# EAGLE design servopoinB3 (EAGLE 6.6.0)
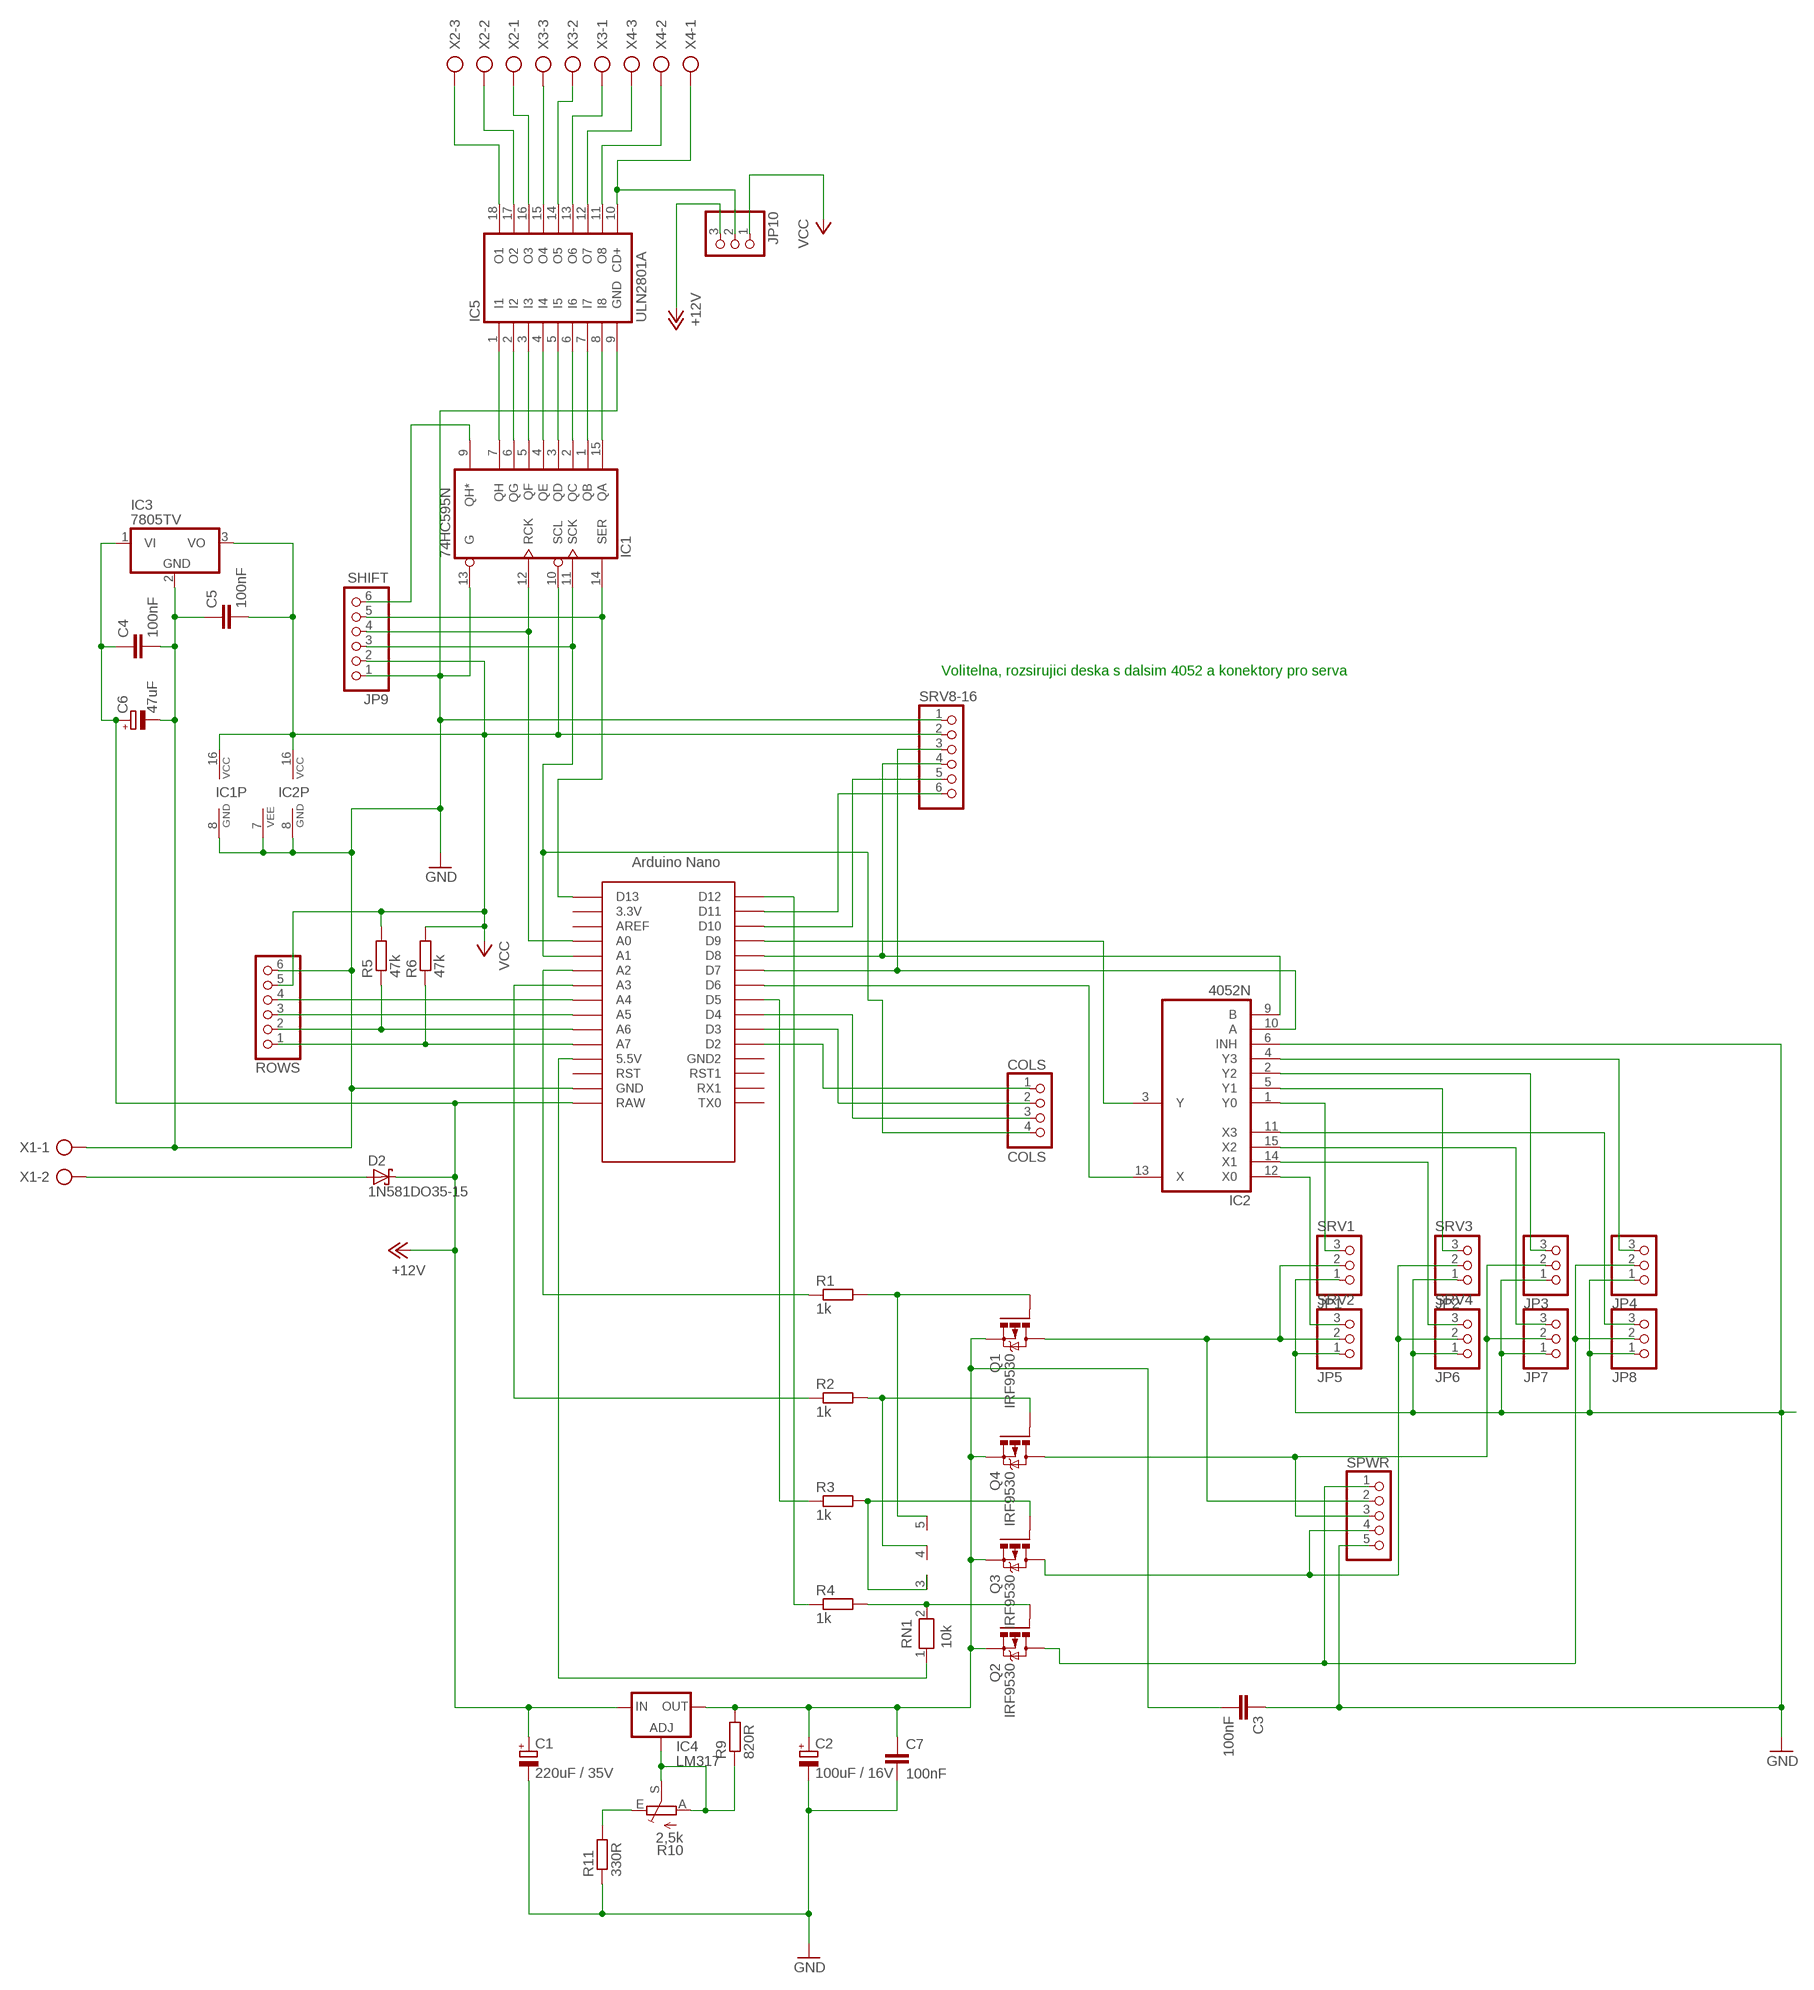
[diagram p0: schematic, sheet 1]

## Parts
C1  220uF / 35V  CPOL-EUE5-10.5  [E5-10,5]
C2  100uF / 16V  CPOL-EUE2.5-5  [E2,5-5]
C3  100nF  C-EU025-025X050  [C025-025X050]
C4  100nF  C-EU025-025X050  [C025-025X050]
C5  100nF  C-EU025-025X050  [C025-025X050]
C6  47uF  CPOL-EUE2.5-6  [E2,5-6]
C7  100nF  C-EU025-025X050  [C025-025X050]
COLS  COLS  PINHD-1X4  [1X04]
D2  1N581DO35-15  [DO35-10]
IC1  74HC595N  [DIL16]
IC2  4052N  [DIL16]
IC3  7805TV  [TO220V]
IC4  LM317  LM317TS  [317TS]
IC5  ULN2801A  [DIL18]
JP1  SRV1  PINHD-1X3  [1X03]
JP2  SRV3  PINHD-1X3  [1X03]
JP3  PINHD-1X3  [1X03]
JP4  PINHD-1X3  [1X03]
JP5  SRV2  PINHD-1X3  [1X03]
JP6  SRV4  PINHD-1X3  [1X03]
JP7  PINHD-1X3  [1X03]
JP8  PINHD-1X3  [1X03]
JP9  SHIFT  PINHD-1X6  [1X06]
JP10  PINHD-1X3  [1X03]
Q1  IRF9530  [TO220BV]
Q2  IRF9530  [TO220BV]
Q3  IRF9530  [TO220BV]
Q4  IRF9530  [TO220BV]
R1  1k  R-EU_0207/10  [0207/10]
R2  1k  R-EU_0207/10  [0207/10]
R3  1k  R-EU_0207/10  [0207/10]
R4  1k  R-EU_0207/10  [0207/10]
R5  47k  R-EU_0207/10  [0207/10]
R6  47k  R-EU_0207/10  [0207/10]
R9  820R  R-EU_0207/10  [0207/10]
R10  2,5k  TRIM_EU-LI10-PADS  [LI10]
R11  330R  R-EU_0207/10  [0207/10]
RN1  10k  RN04  [RN-5]
ROWS  PINHD-1X6  [1X06]
SPWR  PINHD-1X5  [1X05]
SRV8-16  PINHD-1X6  [1X06]
U$1  NANO  [NANO]
X1  AK500/2  [AK500/2]
X2  AK500/3  [AK500/3]
X3  AK500/3  [AK500/3]
X4  AK500/3  [AK500/3]

## Nets
+12V: C1.+ C4.1 C6.+ D2.C IC3.1(VI) IC4.3(IN) JP10.3 U$1.RAW
GND: C1.- C2.- C3.1 C4.2 C5.1 C6.- C7.2 IC1.8(GND) IC1.13(G) IC2.6(INH) IC2.7(VEE) IC2.8(GND) IC3.2(GND) IC5.9(GND) JP1.1 JP2.1 JP3.1 JP4.1 JP5.1 JP6.1 JP7.1 JP8.1 JP9.1 R11.1 ROWS.6 SPWR.5 SRV8-16.1 U$1.GND X1.1
N$1: IC2.13(X) U$1.D6
N$2: IC2.3(Y) U$1.D9
N$3: IC1.15(QA) IC5.8(I8)
N$4: COLS.4 IC1.11(SCK) JP9.3 U$1.A1
N$5: IC2.12(X0) JP5.3
N$6: IC2.1(Y0) JP1.3
N$7: IC2.14(X1) JP6.3
N$8: IC2.5(Y1) JP2.3
N$9: IC2.15(X2) JP7.3
N$10: IC2.2(Y2) JP3.3
N$11: IC2.11(X3) JP8.3
N$12: IC2.4(Y3) JP4.3
N$13: Q1.G R1.2 RN1.5
N$14: JP2.2 JP6.2 Q3.D SPWR.4
N$15: R6.1 ROWS.1 U$1.A7
N$16: R2.1 U$1.A3
N$17: Q4.G R2.2 RN1.4
N$18: R3.1 U$1.D5
N$19: Q3.G R3.2 RN1.3
N$20: RN1.1 U$1.5V(5.5V)
N$21: Q2.G R4.2 RN1.2
N$22: JP3.2 JP7.2 Q4.D SPWR.3
N$23: R4.1 U$1.D12
N$24: R1.1 U$1.A2
N$25: D2.A X1.2
N$26: ROWS.4 U$1.A4
N$27: ROWS.3 U$1.A5
N$28: R5.1 ROWS.2 U$1.A6
N$30: SRV8-16.6 U$1.D11
N$31: COLS.2 U$1.D3
N$32: COLS.3 U$1.D4
N$33: COLS.1 U$1.D2
N$34: SRV8-16.5 U$1.D10
N$35: IC1.14(SER) JP9.5 U$1.D13
N$36: IC1.1(QB) IC5.7(I7)
N$37: IC1.9(QH*) JP9.6
N$38: IC1.12(RCK) JP9.4 U$1.A0
N$39: C2.+ C3.2 C7.1 IC4.2(OUT) Q1.S Q2.S Q3.S Q4.S R9.2
N$40: IC5.10(CD+) JP10.2 X4.1
N$41: IC1.2(QC) IC5.6(I6)
N$42: IC1.3(QD) IC5.5(I5)
N$43: IC1.4(QE) IC5.4(I4)
N$44: IC1.5(QF) IC5.3(I3)
N$45: IC1.6(QG) IC5.2(I2)
N$46: IC1.7(QH) IC5.1(I1)
N$47: IC5.18(O1) X2.3
N$49: IC4.1(ADJ) R9.1 R10.A R10.S
N$50: R10.E R11.2
N$51: IC5.17(O2) X2.2
N$53: JP1.2 JP5.2 Q1.D SPWR.2
N$57: IC5.16(O3) X2.1
N$58: JP4.2 JP8.2 Q2.D SPWR.1
N$59: IC5.15(O4) X3.3
N$60: IC5.14(O5) X3.2
N$61: IC5.13(O6) X3.1
N$62: IC5.12(O7) X4.3
N$63: IC5.11(O8) X4.2
N$64: IC2.9(B) SRV8-16.4 U$1.D8
N$65: IC2.10(A) SRV8-16.3 U$1.D7
VCC: C5.2 IC1.10(SCL) IC1.16(VCC) IC2.16(VCC) IC3.3(VO) JP9.2 JP10.1 R5.2 R6.2 ROWS.5 SRV8-16.2
Unconnected: U$1.3.3V U$1.AREF U$1.GND1(GND2) U$1.ICSP1 U$1.ICSP2 U$1.ICSP3 U$1.ICSP4 U$1.ICSP5 U$1.ICSP6 U$1.RST U$1.RST1 U$1.RX1 U$1.TX0

## Notes on the sheet
- Volitelna, rozsirujici deska s dalsim 4052 a konektory pro serva

## Library data of the parts
C1 C2 = resistor:CPOL-EU: POLARIZED CAPACITOR, European symbol
C3 C7 = resistor:C-EU: CAPACITOR, European symbol
C4 C5 = rcl:C-EU: CAPACITOR, European symbol
C6 = rcl:CPOL-EU: POLARIZED CAPACITOR, European symbol
COLS = pinhead:PINHD-1X4: PIN HEADER
D2 = custom:1N581*: 1.0A SCHOTTKY BARRIER RECTIFIER Source: http://www.diodes.com/datasheets/ds23001.pdf
IC1 = 74xx-eu:74*595: 8-bit SHIFT REGISTER, output latch
IC2 = 40xx:4052: Dual 4-channel ANALOG MULTIPLEXER
IC3 = linear:78*: Positive VOLTAGE REGULATOR Source: http://cache.national.com/ds/LM/LM78L05.pdf http://www.fairchildsemi.com/ds/LM/LM7805.pdf
IC4 = v-reg:LM317TS: VOLTAGE REGULATOR
IC5 = uln-udn:ULN2801A: DRIVER ARRAY
JP1-JP8 JP10 = pinhead:PINHD-1X3: PIN HEADER
JP9 ROWS SRV8-16 = pinhead:PINHD-1X6: PIN HEADER
Q1-Q4 = transistor-power:IRF9530: P-CHANNEL HEXFET POWER-MOS-FET Source: http://www.irf.com/product-info/datasheets/data/irf9530.pdf
R1-R6 R9 R11 = resistor:R-EU_: RESISTOR, European symbol
R10 = custom:TRIM_EU-: POTENTIOMETER
RN1 = resistor-net:RN04: RESISTOR NETWORK; OC_FARNELL: unknown; OC_NEWARK: unknown
SPWR = pinhead:PINHD-1X5: PIN HEADER
U$1 = Arduino-clone:NANO: Arduino Nano
X1 = con-ptr500:AK500/2: CONNECTOR; OC_FARNELL: unknown; OC_NEWARK: unknown
X2-X4 = con-ptr500:AK500/3: CONNECTOR; OC_FARNELL: unknown; OC_NEWARK: unknown

## Board
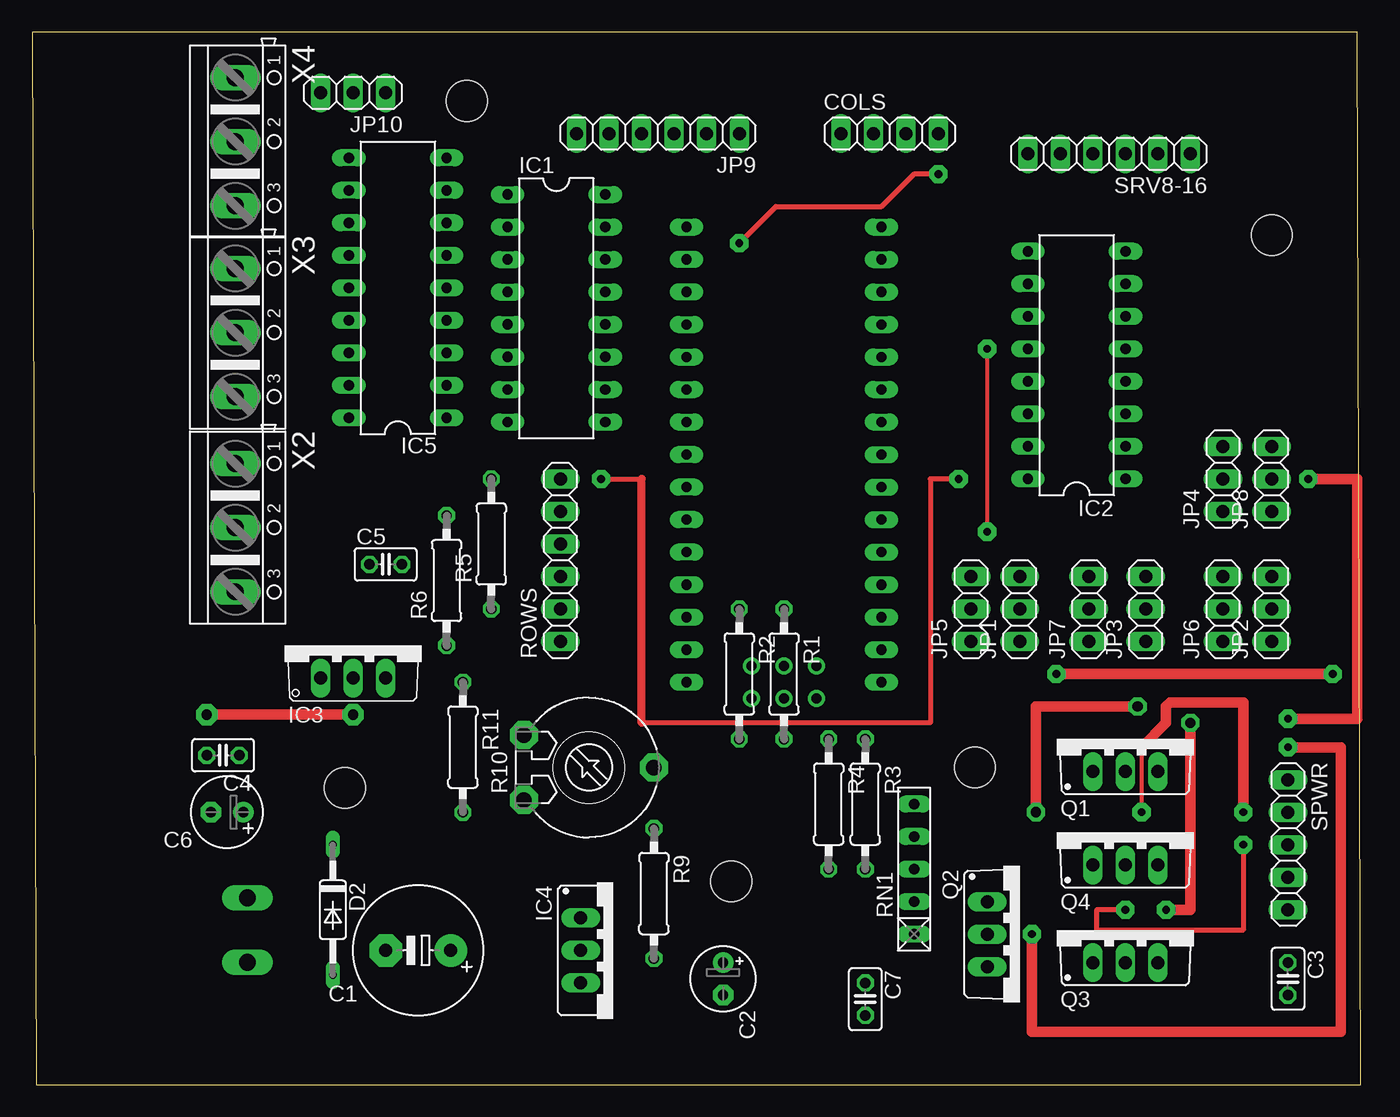
[diagram p1: board, top side]
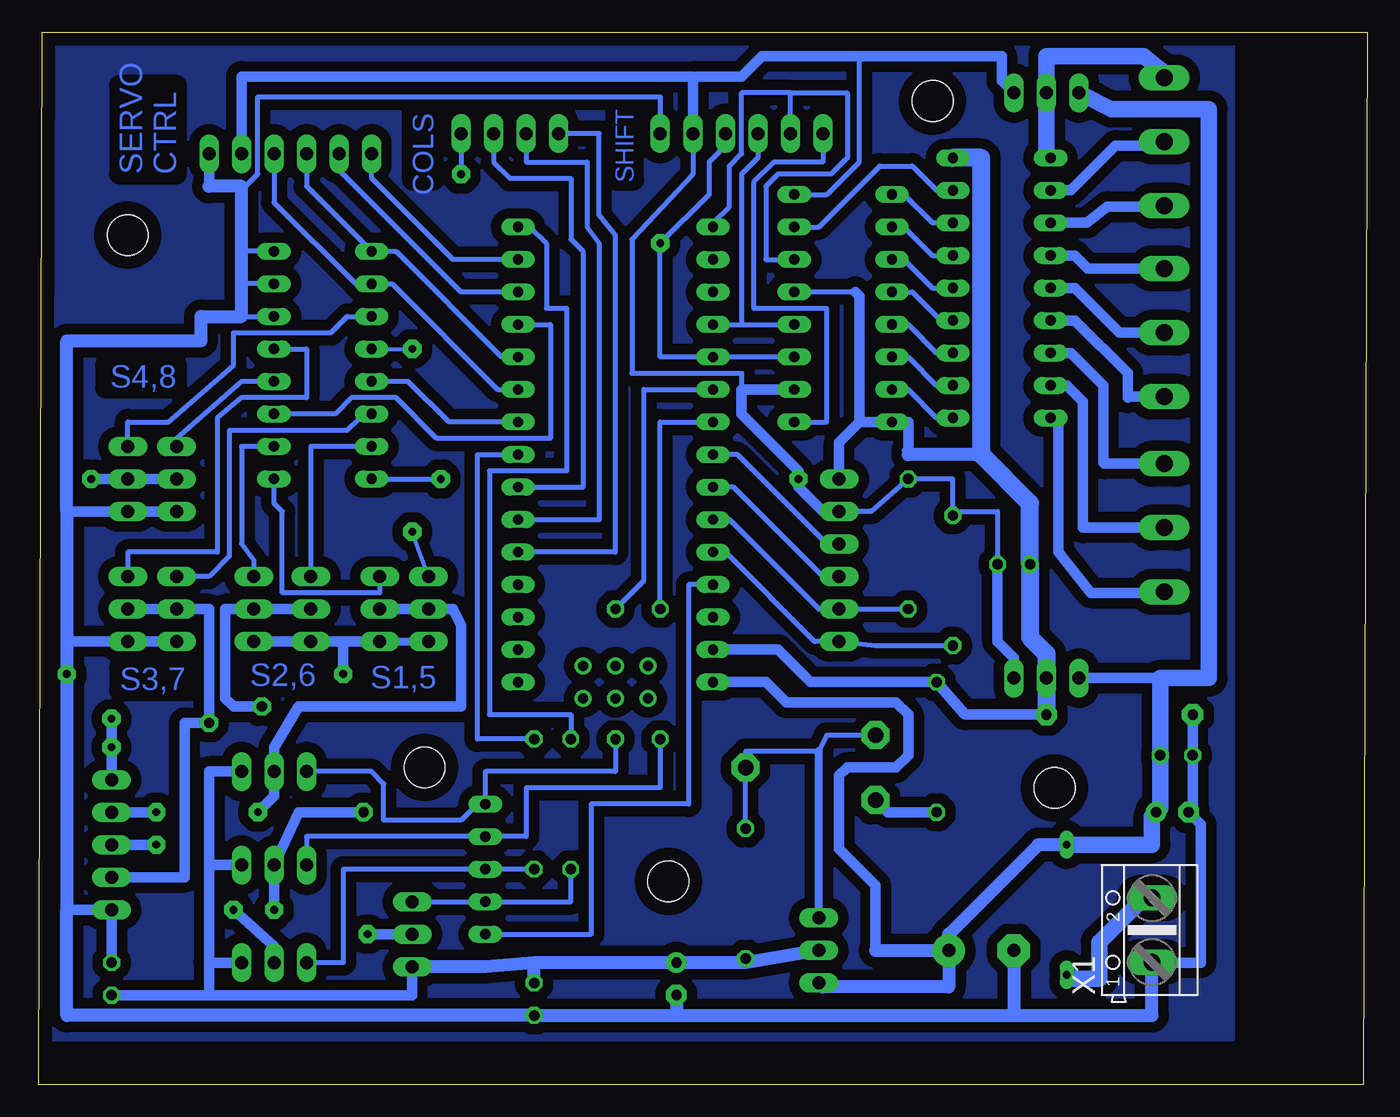
[diagram p2: board, bottom side, seen from below]

Size 103.81 x 82.22 mm. Coordinates in mm from the lower left corner, seen from the top.
Outline: 0.32,0 103.81,0 103.52,82.22 0,82.22 0.32,0
Copper layers (1*16): Top 0.035mm / dielectric 1.5mm / Bottom 0.035mm
Design rules "default *": minimum track width 10mil, minimum drill 0.6mm, track to track 8mil, track to pad 8mil, pad to pad 8mil, via to via 8mil, smd to smd 8mil, copper to edge 40mil, drill to drill 8mil, minimum pad ring 10mil, minimum via ring 8mil, stop-mask expansion 4mil, vias tented up to drill 0mil, thermal gap 10mil
Holes 3.2 mm at 96.84,66.36 54.61,15.88 73.66,24.77 24.45,23.18 33.97,76.84

### Footprints (pad centres in the part's own frame; a part is rotated, then mirrored left to right if it is on the bottom)
E5-10,5 = drill 1.016 pad 2.54: + -2.54,0 | drill 1.016 pad 2.54 octagon: - 2.54,0
E2,5-5 = drill 0.813 pad 1.6: + -1.27,0 | drill 0.813 pad 1.6 octagon: - 1.27,0
C025-025X050 = drill 0.813 octagon: 1 -1.27,0; 2 1.27,0
E2,5-6 = drill 0.813 pad 1.6: + -1.27,0 | drill 0.813 pad 1.6 octagon: - 1.27,0
1X04 = drill 1.016 long: 1 -3.81,0; 2 -1.27,0; 3 1.27,0; 4 3.81,0
DO35-10 = drill 0.6 long: A 5.08,0; C -5.08,0
DIL16 = drill 0.813 long: 1 -8.89,-3.81; 2 -6.35,-3.81; 3 -3.81,-3.81; 4 -1.27,-3.81; 5 1.27,-3.81; 6 3.81,-3.81; 7 6.35,-3.81; 8 8.89,-3.81; 9 8.89,3.81; 10 6.35,3.81; 11 3.81,3.81; 12 1.27,3.81; 13 -1.27,3.81; 14 -3.81,3.81; 15 -6.35,3.81; 16 -8.89,3.81
TO220V = drill 1.016 long: 1 -2.54,-2.54; 2 0,-2.54; 3 2.54,-2.54
317TS = drill 1.016 long: 1 -2.54,-2.54; 2 0,-2.54; 3 2.54,-2.54
DIL18 = drill 0.813 long: 1 -10.16,-3.81; 2 -7.62,-3.81; 3 -5.08,-3.81; 4 -2.54,-3.81; 5 0,-3.81; 6 2.54,-3.81; 7 5.08,-3.81; 8 7.62,-3.81; 9 10.16,-3.81; 10 10.16,3.81; 11 7.62,3.81; 12 5.08,3.81; 13 2.54,3.81; 14 0,3.81; 15 -2.54,3.81; 16 -5.08,3.81; 17 -7.62,3.81; 18 -10.16,3.81
1X03 = drill 1.016 long: 1 -2.54,0; 2 0,0; 3 2.54,0
1X06 = drill 1.016 long: 1 -6.35,0; 2 -3.81,0; 3 -1.27,0; 4 1.27,0; 5 3.81,0; 6 6.35,0
TO220BV = drill 1.016 long: D 0,-2.54; G -2.54,-2.54; S 2.54,-2.54
0207/10 = drill 0.813 octagon: 1 -5.08,0; 2 5.08,0
LI10 = drill 1.2 pad 2.184 octagon: A -2.54,-5.08; E 2.54,-5.08; S 0,5.08
RN-5 = drill 0.813 long: 1 -5.08,0; 2 -2.54,0; 3 0,0; 4 2.54,0; 5 5.08,0
1X05 = drill 1.016 long: 1 -5.08,0; 2 -2.54,0; 3 0,0; 4 2.54,0; 5 5.08,0
NANO = drill 0.8 long: 3.3V -10.16,24.13; 5V -10.16,-1.27; A0 -10.16,19.05; A1 -10.16,16.51; A2 -10.16,13.97; A3 -10.16,11.43; A4 -10.16,8.89; A5 -10.16,6.35; A6 -10.16,3.81; A7 -10.16,1.27; AREF -10.16,21.59; D2 5.08,1.27; D3 5.08,3.81; D4 5.08,6.35; D5 5.08,8.89; D6 5.08,11.43; D7 5.08,13.97; D8 5.08,16.51; D9 5.08,19.05; D10 5.08,21.59; D11 5.08,24.13; D12 5.08,26.67; D13 -10.16,26.67; GND -10.16,-6.35; GND1 5.08,-1.27; RAW -10.16,-8.89; RST -10.16,-3.81; RST1 5.08,-3.81; RX1 5.08,-6.35; TX0 5.08,-8.89 | drill 0.8: ICSP1 -5.08,-10.16; ICSP2 -5.08,-7.62; ICSP3 -2.54,-10.16; ICSP4 -2.54,-7.62; ICSP5 0,-10.16; ICSP6 0,-7.62
AK500/2 = drill 1.321 long: 1 -2.515,0; 2 2.515,0
AK500/3 = drill 1.321 long: 1 -5.004,0; 2 0,0; 3 5.004,0

### Placement (x,y rotation side)
C1  30.16,10.48 180 top
C2  53.98,8.26 270 top
C3  98.11,8.26 270 top
C4  14.92,25.72 180 top
C5  27.62,40.64 0 top
C6  15.24,21.27 180 top
C7  65.09,6.67 270 top
COLS  66.99,74.3 0 top
D2  23.49,13.65 270 top
IC1  40.96,60.64 270 top
IC2  81.6,56.2 90 top
IC3  25.08,34.29 0 top
IC4  45.4,10.48 270 top
IC5  28.57,62.23 90 top
JP1  77.15,37.15 90 top
JP2  96.84,37.15 90 top
JP3  87,37.15 90 top
JP4  93.03,47.31 90 top
JP5  73.34,37.15 90 top
JP6  93.03,37.15 90 top
JP7  82.55,37.15 90 top
JP8  96.84,47.31 90 top
JP9  48.9,74.3 180 top
JP10  25.08,77.47 180 top
Q1  85.41,26.99 0 top
Q2  77.15,11.75 270 top
Q3  85.41,12.06 0 top
Q4  85.41,19.69 0 top
R1  58.74,32.07 270 top
R2  55.24,32.07 270 top
R3  65.09,21.91 270 top
R4  62.23,21.91 270 top
R5  35.88,42.23 90 top
R6  32.39,39.37 90 top
R9  48.58,14.92 270 top
R10  43.5,24.77 270 top
R11  33.66,26.35 270 top
RN1  68.9,16.83 90 top
ROWS  41.27,40.96 90 top
SPWR  98.11,18.73 270 top
SRV8-16  84.14,72.71 180 top
U$1  61.28,40.32 0 top
X1  16.83,12.06 90 bottom
X2  15.88,43.5 270 top
X3  15.88,58.74 270 top
X4  15.88,73.66 270 top

### Tracks (layer width: path | path; a pad name or v marks a point on that pad's centre or on a via)
+12V
  Bottom 0.813: IC3.1 16.19,31.75 | U$1.RAW 46.99,31.43 45.4,29.85 36.83,29.85 35.88,28.89 35.88,25.72 36.83,24.77 40.64,24.77 41.27,24.13 41.27,18.42 38.42,15.56 38.42,10.48 | 16.83,20.96 C6.+ 16.19,21.59
  Bottom 1.016: C1.+ 32.7,7.62 42.55,7.62 IC4.3 | D2.C 25.72,18.73 32.7,11.75 C1.+ | 38.42,10.48 C1.+
  Bottom 1.27: JP10.3 20,76.2 12.38,76.2 12.38,31.75 16.19,31.75 C4.1 16.19,21.59 | D2.C 16.83,18.73 16.83,20.96
AAA
  pour Bottom (isolate 0.813): 10.48,81.92 103.19,81.92 103.19,3.49 10.48,3.49
GND  (via drill 0.6 pad 1.42, 0.8 pad 1.68)
  Top 0.813: v101.6,32.07 v80.01,32.07 | v25.08,28.89 v13.65,28.89
  Bottom 0.406: IC1.8 35.88,51.75 | IC2.8 87.95,65.09 | 87.95,60.01 IC2.6 | 39.69,61.91 40.01,61.91 IC1.13 | IC2.7 87.63,62.55 87.95,62.86 | 87.95,70.17 87.63,70.17 86.68,71.12 86.68,77.15 55.24,77.15 JP9.1 | 35.88,49.21 36.2,49.53 | 43.5,31.43 43.81,31.75
  Bottom 0.61: JP1.1 JP5.1
  Bottom 0.813: JP1.1 80.01,34.61 | 80.01,34.61 JP7.1 JP3.1 | JP6.1 JP2.1 101.6,34.61 | JP4.1 JP8.1 101.6,44.77 | 101.6,13.65 SPWR.5 C3.1 | IC2.6 86.04,60.01 | 90.49,70.17 SRV8-16.1 | 35.88,51.75 35.88,49.21 | IC1.8 39.69,51.75 | 39.69,51.75 39.69,61.59 40.01,61.91 | IC5.9 33.02,72.39 | U$1.GND 46.04,33.97 43.81,31.75 | ROWS.6 41.27,50.16 39.69,51.75 | 80.01,34.61 v80.01,32.07 | v25.08,28.89 31.43,28.89 R11.1 43.5,31.43 | 16.54,9.84 X1.1 16.8,9.53 13.02,9.53 13.02,20.32 C6.- 13.65,21.59 C4.2 v13.65,28.89
  Bottom 1.016: 90.49,70.17 87.95,70.17 87.95,65.09 87.95,62.86 87.95,60.01 91.12,60.01 91.12,58.1 101.6,58.1 101.6,44.77 101.6,34.61 v101.6,32.07 101.6,13.65 101.6,5.4 C7.2 53.98,5.4 | 30.16,49.21 35.88,49.21 | 53.98,5.4 27.62,5.4 | 27.62,5.4 16.83,5.4 X1.1 | C1.- 27.62,5.4 | C2.- 53.98,5.4
  Bottom 1.422: IC5.9 30.16,72.39 30.16,49.21 26.35,45.4 C5.1 26.35,34.92 25.08,33.66 IC3.2 v25.08,28.89
N$1
  Bottom 0.406: U$1.D6 71.76,51.75 74.93,54.93 IC2.13
N$2
  Bottom 0.406: U$1.D9 63.82,59.37 63.82,50.48 72.71,50.48 75.88,53.66 79.38,53.66 80.64,52.39 IC2.3
N$3
  Bottom 0.406: IC1.15 42.86,66.99 38.1,71.76 35.56,71.76 33.66,69.85 IC5.8
N$4  (via drill 0.6 pad 1.42)
  Top 0.406: v70.8,71.12 68.9,71.12 66.36,68.58 58.1,68.58 v55.24,65.72
  Bottom 0.406: IC1.11 U$1.A1 55.24,56.83 v55.24,65.72 51.44,69.53 51.44,72.07 50.16,73.34 JP9.3 | COLS.4 v70.8,71.12
N$5  (via drill 0.6 pad 1.42)
  Top 0.305: v74.61,43.18 v74.61,57.47
  Bottom 0.305: JP5.3 v74.61,43.18 | IC2.12 v74.61,57.47
N$6
  Bottom 0.406: JP1.3 77.15,38.42 84.77,38.42 84.77,44.77 85.41,45.4 IC2.1
N$7
  Bottom 0.406: IC2.14 78.11,52.07 78.74,52.07 79.69,51.12 88.9,51.12 88.9,41.27 90.49,39.69 JP6.3
N$8
  Bottom 0.406: IC2.5 82.87,57.47 82.87,53.66 87.95,53.66 89.85,52.07 89.85,41.59 96.84,41.59 JP2.3
N$9
  Bottom 0.406: IC2.15 82.55,49.85 JP7.3
N$10
  Bottom 0.406: IC2.2 87.95,49.85 87.95,42.23 87,40.96 JP3.3
N$11
  Bottom 0.406: JP8.3 96.84,51.75 93.66,51.75 88.58,56.2 88.58,58.74 80.96,58.74 79.69,60.01 IC2.11
N$12
  Bottom 0.406: IC2.4 87.95,54.93 93.03,50.48 JP4.3
N$13
  Bottom 0.406: R1.2 58.74,24.45 68.9,24.45 RN1.5 69.53,21.91 70.8,20.64 76.83,20.64 76.83,23.5 77.79,24.45 Q1.G
N$14  (via drill 0.6 pad 1.42, 0.8 pad 1.42)
  Top 0.813: v88.58,13.65 90.49,13.65 v90.49,28.26
  Bottom 0.406: 91.12,28.26 v90.49,28.26
  Bottom 0.813: JP2.2 JP6.2 90.49,37.15 v90.49,28.26 | SPWR.4 92.39,16.19 92.39,28.26 91.12,28.26 | Q3.D 85.41,10.79 v88.58,13.65
N$15
  Bottom 0.406: R6.1 38.42,34.29 ROWS.1 43.18,34.61 50.16,41.59 U$1.A7
N$16
  Bottom 0.406: R2.1 55.24,51.75 U$1.A3
N$17
  Bottom 0.406: R2.2 55.24,23.18 65.72,23.18 65.72,19.37 RN1.4 82.87,19.37 Q4.G
N$18
  Bottom 0.406: R3.1 69.53,26.99 69.53,49.21 U$1.D5
N$19
  Bottom 0.406: Q3.G 80.01,9.53 80.01,16.83 RN1.3 R3.2
N$20
  Bottom 0.406: RN1.1 60.64,11.75 60.64,21.91 53.02,21.91 53.02,39.05 U$1.5V
N$21
  Bottom 0.406: Q2.G RN1.2 62.23,14.29 R4.2
N$22  (via drill 0.6 pad 1.42, 0.8 pad 1.42)
  Top 0.406: v94.61,18.73 94.61,12.06 83.19,12.06 83.19,13.65 v85.41,13.65
  Top 0.813: v86.36,29.53 78.42,29.53 v78.42,21.27
  Bottom 0.813: v78.42,21.27 83.5,21.27 Q4.D v85.41,13.65 | JP7.2 JP3.2 89.22,37.15 89.22,30.16 88.58,29.53 v86.36,29.53 | SPWR.3 v94.61,18.73
N$23
  Bottom 0.406: U$1.D12 65.41,66.99 64.13,65.72 64.13,60.64 62.55,60.64 62.55,47.94 68.58,47.94 68.58,28.89 62.23,28.89 R4.1
N$24
  Bottom 0.406: U$1.A2 56.52,54.29 56.52,39.37 R1.1
N$25
  Bottom 1.016: 23.18,8.26 D2.A
  Bottom 1.27: 17.49,14.58 20.96,11.11 20.96,8.26 23.18,8.26
  Bottom 1.422: X1.2 17.49,14.58
N$26
  Bottom 0.406: ROWS.4 42.23,42.23 49.21,49.21 U$1.A4
N$27
  Bottom 0.406: ROWS.3 42.55,39.69 49.53,46.67 U$1.A5
N$28
  Bottom 0.406: R5.1 ROWS.2 42.86,37.15 49.85,44.13 U$1.A6
N$30
  Bottom 0.406: U$1.D11 71.44,64.45 77.79,70.8 SRV8-16.6
N$31
  Bottom 0.406: COLS.2 65.72,72.07 60.96,72.07 60.96,66.99 60.01,65.72 60.01,44.13 U$1.D3
N$32
  Bottom 0.406: COLS.3 68.26,72.07 66.99,70.8 62.23,70.8 62.23,66.04 61.28,65.09 61.28,46.67 U$1.D4
N$33
  Bottom 0.406: COLS.1 60.01,74.3 60.01,67.95 58.74,66.36 58.74,41.59 U$1.D2
N$34
  Bottom 0.406: U$1.D10 70.8,61.91 80.33,71.44 SRV8-16.5
N$35
  Bottom 0.406: JP9.5 45.09,77.47 | 45.09,77.47 40.64,77.47 40.64,72.39 41.91,71.12 46.04,71.12 46.99,70.17 46.99,64.45 IC1.14 | 45.09,77.47 48.9,77.47 48.9,72.71 49.85,71.76 49.85,68.58 51.12,67.31 U$1.D13
N$36
  Bottom 0.406: IC1.1 36.2,69.53 33.97,67.31 IC5.7
N$37
  Bottom 0.406: JP9.6 42.55,72.07 46.35,72.07 47.94,70.48 47.94,60.64 42.23,60.64 42.23,51.75 IC1.9
N$38
  Bottom 0.406: U$1.A0 48.9,59.37 | 48.9,59.37 IC1.12 | 48.9,59.37 48.9,71.12 47.63,72.39 JP9.4
N$39
  Bottom 0.406: R9.2 48.58,9.53
  Bottom 0.813: Q1.S 90.49,24.45 90.49,17.15 | 90.49,17.15 90.49,9.53 | 90.49,9.53 90.49,6.98 | 90.49,6.98 74.61,6.98 Q2.S | Q3.S 90.49,9.53 | Q4.S 90.49,17.15 | C3.2 90.49,6.98
  Bottom 1.016: IC4.2 48.58,9.53 C2.+ 65.09,9.53 | 65.09,9.53 68.9,9.21 Q2.S | C7.1 65.09,9.53
N$40
  Bottom 0.406: X4.1 15.88,79.06
  Bottom 0.813: 25.08,72.71 IC5.10
  Bottom 1.27: 25.08,72.71 JP10.2 25.08,80.33 17.46,80.33 15.88,79.06
N$41
  Bottom 0.406: IC1.2 36.2,66.99 33.97,64.77 IC5.6
N$42
  Bottom 0.406: IC1.3 36.2,64.45 33.97,62.23 IC5.5
N$43
  Bottom 0.406: IC1.4 35.56,61.91 33.34,59.69 IC5.4
N$44
  Bottom 0.406: IC1.5 35.88,59.37 33.66,57.15 IC5.3
N$45
  Bottom 0.406: IC1.6 35.88,56.83 33.66,54.61 IC5.2
N$46
  Bottom 0.406: IC1.7 35.88,54.29 33.66,52.07 IC5.1
N$47
  Bottom 0.406: IC5.18 24.13,52.07 | 16.51,38.42 15.88,39.05 X2.3
  Bottom 0.813: 24.13,52.07 24.13,41.59 21.59,38.42 16.51,38.42
N$49
  Bottom 0.406: R9.1 R10.S 48.58,26.04 42.86,26.04 42.23,27.31 R10.A
  Bottom 0.61: IC4.1 42.86,26.04
N$50
  Bottom 0.813: R11.2 37.46,21.27 R10.E
N$51
  Bottom 0.813: X2.2 22.22,43.5 22.22,53.34 23.49,54.61 IC5.17
N$53  (via drill 0.6 pad 1.42)
  Top 0.305: v86.68,21.27 86.68,26.35
  Top 0.813: v94.61,21.27 94.61,29.85 88.9,29.85 88.58,29.53 88.58,28.26 86.68,26.35
  Bottom 0.813: JP1.2 JP5.2 71.44,37.15 70.8,35.88 70.8,29.53 83.5,29.53 85.41,26.35 Q1.D 85.41,22.54 v86.68,21.27 | SPWR.2 v94.61,21.27
N$57
  Bottom 0.406: 20.56,48.5 20.64,48.58
  Bottom 0.813: X2.1 20.56,48.5 | 20.64,48.58 20.64,54.61 23.18,57.15 IC5.16
N$58  (via drill 0.6 pad 1.42)
  Top 0.813: v98.11,26.35 102.23,26.35 102.23,4.13 78.11,4.13 v78.11,11.75 | v98.11,28.58 103.5,28.58 103.5,47.31 v99.69,47.31
  Bottom 0.813: JP4.2 JP8.2 v99.69,47.31 | Q2.D v78.11,11.75 | SPWR.1 v98.11,26.35 v98.11,28.58
N$59
  Bottom 0.406: 18.66,53.73 18.73,53.66
  Bottom 0.813: X3.3 18.66,53.73 | 18.73,53.66 18.73,55.56 22.86,59.69 IC5.15
N$60
  Bottom 0.813: X3.2 19.37,58.74 22.86,62.23 IC5.14
N$61
  Bottom 0.813: X3.1 21.83,63.74 22.86,64.77 IC5.13
N$62
  Bottom 0.406: 16.12,68.58 X4.3
  Bottom 0.813: IC5.12 21.91,67.31 20.32,68.58 16.12,68.58
N$63
  Bottom 0.406: 16.19,73.34 X4.2
  Bottom 0.813: IC5.11 23.18,69.85 19.69,73.34 16.19,73.34
N$64
  Bottom 0.406: SRV8-16.4 82.87,70.17 IC2.9 75.88,65.09 67.63,56.83 U$1.D8
N$65
  Bottom 0.406: SRV8-16.3 85.41,68.9 79.06,62.55 IC2.10 76.2,62.55 67.95,54.29 U$1.D7
VCC  (via drill 0.6 pad 1.42)
  Top 0.406: v72.39,47.31 70.17,47.31 70.17,28.26 47.63,28.26 | v44.45,47.31 47.63,47.31
  Top 0.61: 47.63,28.26 47.63,47.31
  Bottom 0.406: JP9.2 52.7,71.12 57.47,66.04 57.47,55.56 48.9,55.56 48.9,54.29 | 78.42,47.31 IC2.16 v72.39,47.31 | IC1.16 42.23,69.53 39.69,72.07 39.69,80.33 | 42.55,44.77 ROWS.5 38.73,44.77 R5.2 32.39,47.31 32.39,44.77 | R6.2 32.39,44.77 | 32.39,44.77 28.89,44.77 C5.2
  Bottom 0.813: IC1.10 48.9,54.29 48.9,52.39 44.45,47.94 v44.45,47.31 44.45,46.67 42.55,44.77 | 52.7,78.42 52.7,78.74 87.95,78.74 SRV8-16.2 | 52.7,78.42 JP9.2 | JP10.1 28.57,78.42 28.57,80.33 39.69,80.33 47.31,80.33 48.9,78.74 52.39,78.74 52.7,78.42 | IC3.3 27.62,33.34 28.89,34.61 C5.2

### Text on the board
Bottom: SHIFT | COLS | SERVO / CTRL | S4,8 | S1,5 | S2,6 | S3,7